# Altium schematic sheet STM_Bluetooth.SchDoc
size A4; DrawnBy: Marin Sinožić; SheetNumber: 2; SheetTotal: 6
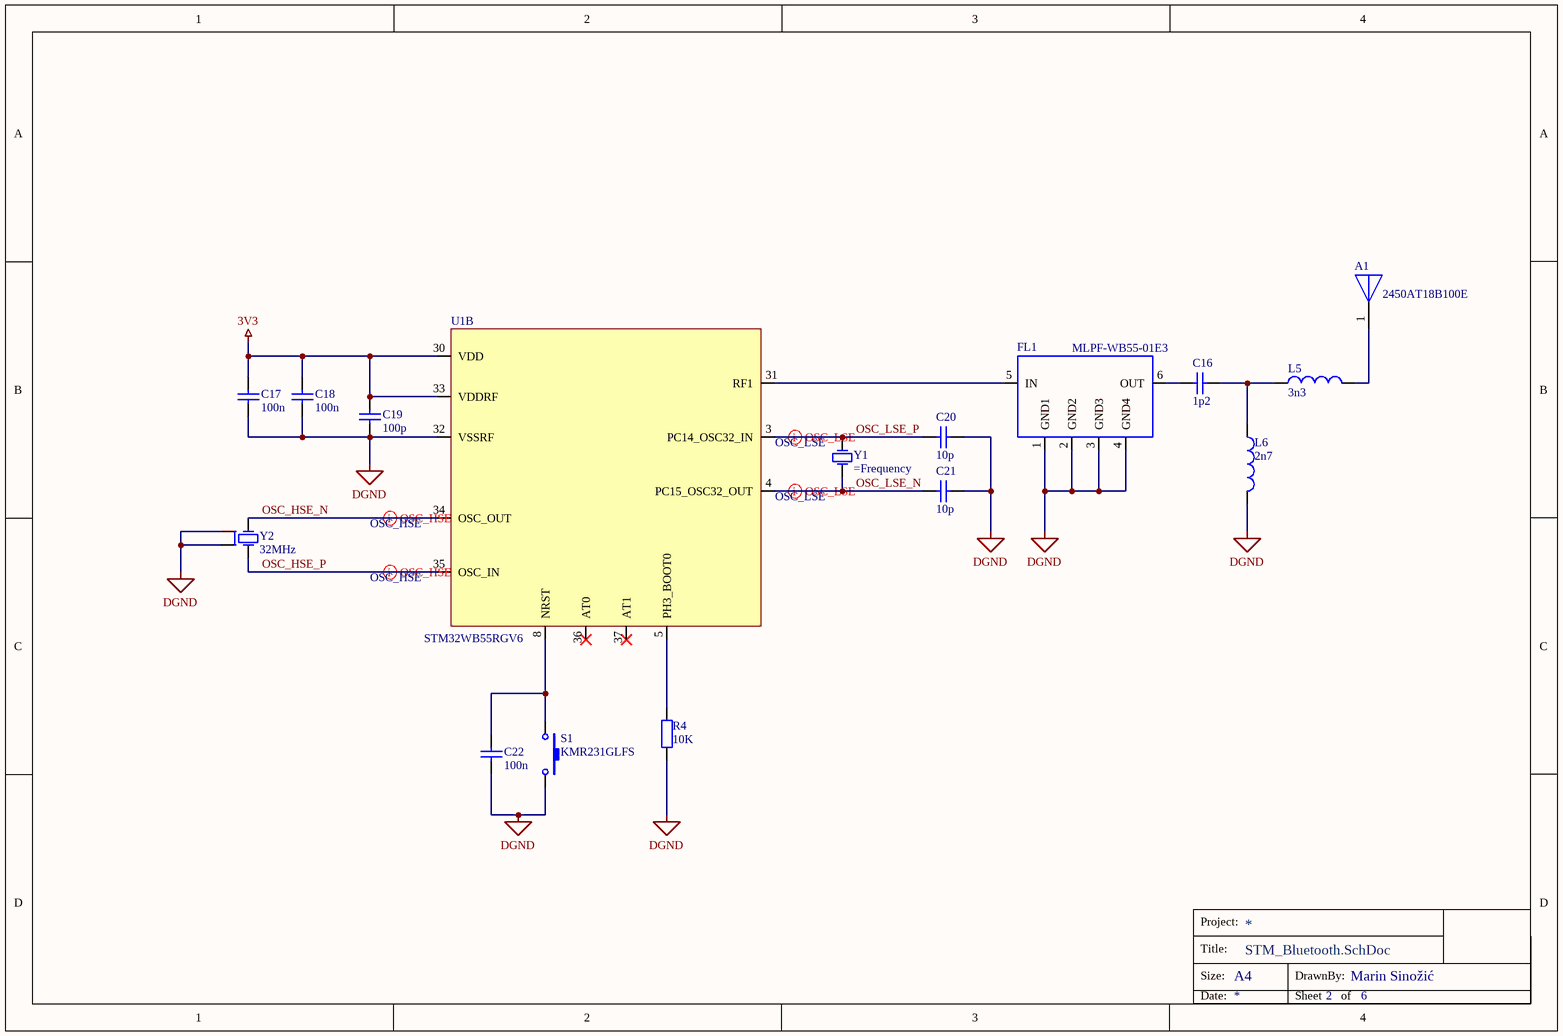
[diagram p0: STM_Bluetooth.SchDoc]

## Parts
A1  2450AT18B100E  [ANT_2450AT18B100E]
C16  1p2  [0402]
C17  100n  [0603]
C18  100n  [0603]
C19  100p  [0603]
C20  10p  [0603]
C21  10p  [0603]
C22  100n  [0603]
FL1  MLPF-WB55-01E3  [CSP_BUMPLESS]
L5  3n3  [0402]
L6  2n7  [0402]
R4  10K  [0603]
S1  KMR231GLFS  [SW-PB SMD KMR2]
U1  STM32WB55RGV6  [Model Name]  (part B of 3)
Y1  (no value)  [NX2012_2P]
Y2  32MHz  [NX2016_4P]

## Nets
3V3: C17.2 C18.2 C19.2 U1.30(VDD) U1.33(VDDRF)
DGND: C17.1 C18.1 C19.1 C20.2 C21.2 C22.1 FL1.1(GND1) FL1.2(GND2) FL1.3(GND3) FL1.4(GND4) L6.2 R4.1 S1.2 U1.32(VSSRF) Y2.2 Y2.4
OSC_HSE_N: U1.34(OSC_OUT) Y2.1(OSC1)
OSC_HSE_P: U1.35(OSC_IN) Y2.3(OSC2)
OSC_LSE_N: C21.1 U1.4(PC15_OSC32_OUT) Y1.1(OSC1)
OSC_LSE_P: C20.1 U1.3(PC14_OSC32_IN) Y1.2(OSC2)
NetA1_1: A1.1 L5.2
NetC16_1: C16.1 L5.1 L6.1
NetC16_2: C16.2 FL1.6(OUT)
NetC22_2: C22.2 S1.1 U1.8(NRST)
NetFL1_5: FL1.5(IN) U1.31(RF1)
NetR4_2: R4.2 U1.5(PH3_BOOT0)

Not connected (* = marked no-connect by the designer): U1 36(AT0)* 37(AT1)*

## Layout directives
differential pair; differential pair class OSC_LSE; net class *: OSC_LSE_P
differential pair; differential pair class OSC_LSE: OSC_LSE_N
differential pair; differential pair class OSC_HSE: OSC_HSE_N
differential pair; differential pair class OSC_HSE; differential pair class OSC_HSE: OSC_HSE_P

## Notes on the sheet
- Project:
- Title:
- Size:
- A4
- DrawnBy:
- Date:
- Sheet
- of

## Library data of the parts
A1 = BT_ANTENNA: RF ANT 2.4GHZ CHIP SOLDER SMD; Manufacturer Part Number: 712-1006-1-ND; Supplier 1: Digi-Key; Price: 0.56
C16 = Cap: CAP CER 1.2PF 50V C0G/NP0 0402; Manufacturer Part Number: 712-1268-1-ND; Value: 1p2; Supplier 1: Digi-Key; Price: 0.18
C17 C18 C22 = Cap: CAP CER 0.1UF 50V X7R 0603; Manufacturer Part Number: 1276-CL10B104KB8WPNDCT-ND; Value: 100n; Supplier 1: Digi-Key; Price: 0.1
C19 = Cap: CAP CER 100PF 50V X7R 0603; Manufacturer Part Number: 1276-1908-1-ND; Value: 100p; Supplier 1: Digi-Key; Price: 0.1
C20 C21 = Cap: CAP CER 10PF 50V X7R 0603; Manufacturer Part Number: 399-C0603C100J5RAC7867CT-ND; Value: 10p; Supplier 1: Digi-Key; Price: 0.25
FL1 = FLT_2.4GHz: RF Filter Low Pass 2400MHz to 2500MHz 1.1dB 50Ohm SMD 6Pin T/R; Supplier 1: Digi-Key; Manufacturer Part Number: MLPF-WB55-01E3; Price: 0.39
L5 = L_0805_10uH: FIXED IND 3.3NH 300MA 190MOHM SM; Manufacturer Part Number: 712-1416-1-ND; Supplier 1: Digi-Key; Value: 3n3; Price: 0.1
L6 = L_0805_10uH: FIXED IND 2.7NH 300MA 170MOHM SM; Manufacturer Part Number: 712-1415-1-ND; Supplier 1: Digi-Key; Value: 2n7; Price: 0.1
R4 = Res2: RES SMD 10K OHM 0.5% 1/5W 0603; Manufacturer Part Number: P20397CT-ND; Value: 10K; Supplier 1: Digi-Key; Price: 0.16
S1 = SW-PB: Switch Tactile N.O. SPST Button Gull Wing 0.05A 32VDC 1VA 150000Cycles 3N SMD T/R; Manufacturer Part Number: 1437636; Supplier 1: Farnell; Price: 0,49
U1 = STM32WB55RGV6: MCU 32-Bit STM32WB55 ARM Cortex M4 RISC 1MB Flash 1.7V to 3.6V 68-Pin VFQFPN Tray
Y1 = OSC_LFXTAL073170_32.768kHz: NDK 32.76kHz Crystal Unit ±20ppm SMD 2-Pin 2.05 x 1.2 x 0.55mm; Manufacturer Part Number: 644-1219-1-ND; Supplier 1: Digi-Key; Price: 0.91
Y2 = OSC_LFXTAL073170_32MHz: Crystal 32.0MHZ 10PF SMD Esr 60; Manufacturer Part Number: 1923-1603-1-ND; Supplier 1: Digi-Key; Price: 0.66